# Altium schematic sheet HPDv2.SchDoc
size A4
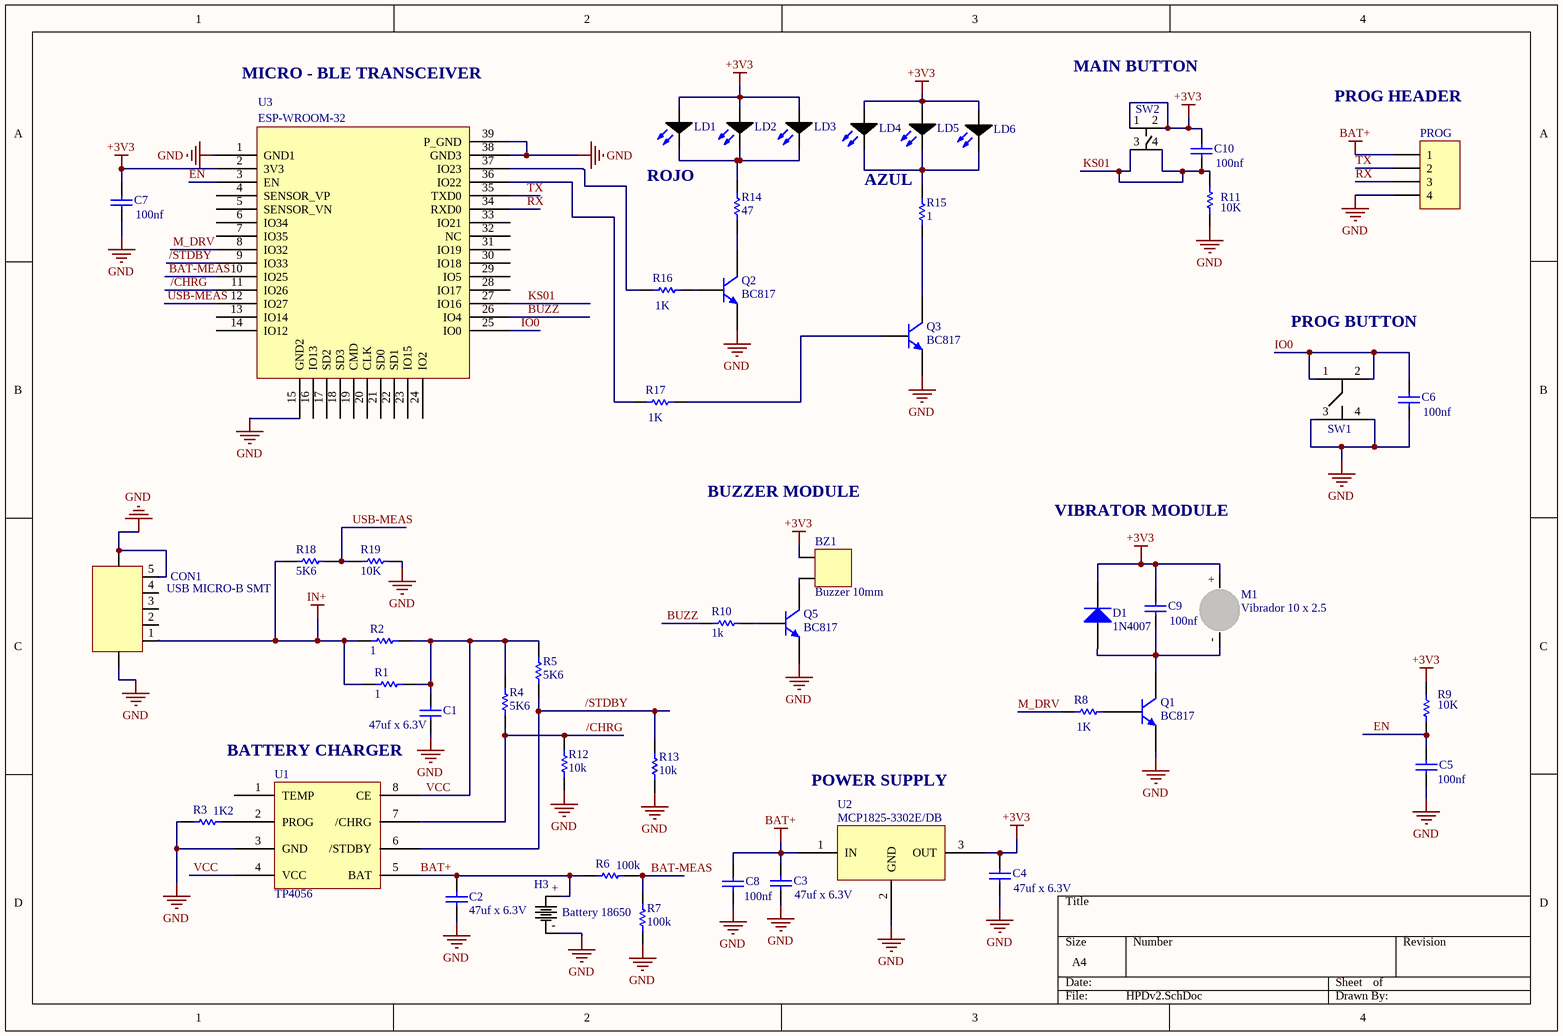
[diagram p0: HPDv2.SchDoc]

## Parts
BZ1  Buzzer 10mm  [BUZZER 10MM]
C1  Valor: 47uf x 6.3V  [8-1206 CAP]  (hidden comment: 47UFX6.3V 20%. TANT SMD1206)
C2  Valor: 47uf x 6.3V  [8-1206 CAP]  (hidden comment: 47UFX6.3V 20%. TANT SMD1206)
C3  Valor: 47uf x 6.3V  [8-1206 CAP]  (hidden comment: 47UFX6.3V 20%. TANT SMD1206)
C4  Valor: 47uf x 6.3V  [8-1206 CAP]  (hidden comment: 47UFX6.3V 20%. TANT SMD1206)
C5  Valor: 100nf  [0805 CAP]  (hidden comment: 100NFX50V X7R 10% CER.MULT. SMD 0805)
C6  Valor: 100nf  [0805 CAP]  (hidden comment: 100NFX50V X7R 10% CER.MULT. SMD 0805)
C7  Valor: 100nf  [0805 CAP]  (hidden comment: 100NFX50V X7R 10% CER.MULT. SMD 0805)
C8  Valor: 100nf  [0805 CAP]  (hidden comment: 100NFX50V X7R 10% CER.MULT. SMD 0805)
C9  Valor: 100nf  [0805 CAP]  (hidden comment: 100NFX50V X7R 10% CER.MULT. SMD 0805)
C10  Valor: 100nf  [0805 CAP]  (hidden comment: 100NFX50V X7R 10% CER.MULT. SMD 0805)
CON1  USB MICRO-B SMT  [MICRO USB-B SMT]
D1  Valor: 1N4007  [SMA]  (hidden comment: M7 DIODO 1A 1000V SMD-SMA (1N4007) XYG)
H3  Battery 18650  [Battery 18650 Holder SMD]
LD1  LED SMD 1206 FRONTAL (YOKE) ROJO WC 54mcd  [Diode-1206]  (value not drawn)
LD2  LED SMD 1206 FRONTAL (YOKE) ROJO WC 54mcd  [Diode-1206]  (value not drawn)
LD3  LED SMD 1206 FRONTAL (YOKE) ROJO WC 54mcd  [Diode-1206]  (value not drawn)
LD4  LED SMD 1206 AZUL WC 100mcd  [Diode-1206]  (value not drawn)
LD5  LED SMD 1206 AZUL WC 100mcd  [Diode-1206]  (value not drawn)
LD6  LED SMD 1206 AZUL WC 100mcd  [Diode-1206]  (value not drawn)
M1  Vibrador 10 x 2.5  [Vibrador]
PROG  POSTE RECTO 4C SF P=2.54MM 201-S104  [HDR1X4]  (value not drawn)
Q1  Valor: BC817  [SOT95P240-3N]  (hidden comment: BC817-40 TRA.NPN 45V0.5A 0.25W SOT23)
Q2  Valor: BC817  [SOT95P240-3N]  (hidden comment: BC817-40 TRA.NPN 45V0.5A 0.25W SOT23)
Q3  Valor: BC817  [SOT95P240-3N]  (hidden comment: BC817-40 TRA.NPN 45V0.5A 0.25W SOT23)
Q5  Valor: BC817  [SOT95P240-3N]  (hidden comment: BC817-40 TRA.NPN 45V0.5A 0.25W SOT23)
R1  Valor: 1  [0805 RES]  (hidden comment: 1E 5% 0805 1/8W)
R2  Valor: 1  [0805 RES]  (hidden comment: 1E 5% 0805 1/8W)
R3  Valor: 1K2  [0805 RES]  (hidden comment: 1K2 5% 0805 1/8W)
R4  Valor: 5K6  [0805 RES]  (hidden comment: 5.6K 5% 0805 1/8W RES.SMD)
R5  Valor: 5K6  [0805 RES]  (hidden comment: 5.6K 5% 0805 1/8W RES.SMD)
R6  Valor: 100k  [0805 RES]  (hidden comment: 100K 5% 0805 1/8W RES.SMD)
R7  Valor: 100k  [0805 RES]  (hidden comment: 100K 5% 0805 1/8W RES.SMD)
R8  Valor: 1K  [0805 RES]  (hidden comment: 1K 5% 0805 1/8W RES.SMD)
R9  Valor: 10K  [0805 RES]  (hidden comment: 10K 5% 0805 1/8W RES.SMD)
R10  Valor: 1k  [0805 RES]  (hidden comment: 1K 5% 0805 1/8W RES.SMD)
R11  Valor: 10K  [0805 RES]  (hidden comment: 10K 5% 0805 1/8W RES.SMD)
R12  Valor: 10k  [0805 RES]  (hidden comment: 10K 5% 0805 1/8W RES.SMD)
R13  Valor: 10k  [0805 RES]  (hidden comment: 10K 5% 0805 1/8W RES.SMD)
R14  Valor: 47  [0805 RES]  (hidden comment: 47E 5% 0805 1/8W RES.SMD)
R15  Valor: 1  [0805 RES]  (hidden comment: 1E 5% 0805 1/8W)
R16  Valor: 1K  [0805 RES]  (hidden comment: 1K 5% 0805 1/8W RES.SMD)
R17  Valor: 1K  [0805 RES]  (hidden comment: 1K 5% 0805 1/8W RES.SMD)
R18  Valor: 5K6  [0805 RES]  (hidden comment: 5.6K 5% 0805 1/8W RES.SMD)
R19  Valor: 10K  [0805 RES]  (hidden comment: 10K 5% 0805 1/8W RES.SMD)
SW1  TAC-SWITCH 4 CONT.6X6MM (7MM) 180GF  [SW - SMD]  (value not drawn)
SW2  Tact swith 12 x 12  [Tact swith 12 x 12]  (value not drawn)
U1  TP4056  [SOIC-8]
U2  Valor: MCP1825-3302E/DB  [SOT223]  (hidden comment: MCP1825S-3302E/DB SOT223)
U3  ESP32-WROOM-32D MODULO WI-FI+BLUETOOTH V4.2 SMD C/ANTENA  [ESP-WROOM-32]  (value not drawn)

## Nets
+3V3: BZ1.1 C4.2 C7.2 C9.2 C10.2 D1.2(K) LD1.1 LD2.1 LD3.1 LD4.1 LD5.1 LD6.1 M1.+ R9.2 SW2.1 SW2.2 U2.3(OUT) U3.2(3V3)
BAT+: C2.1 C3.2 C8.2 H3.+ PROG.1 R6.2 U1.5(BAT) U2.1(IN)
GND: C1.1 C2.2 C3.1 C4.1 C5.1 C6.1 C7.1 C8.1 CON1.5 CON1.6 H3.- PROG.4 Q1.2(E) Q2.2(E) Q3.2(E) Q5.2(E) R3.2 R7.2 R11.1 R12.2 R13.2 R19.1 SW1.3 SW1.4 U1.3(GND) U2.2(GND) U3.1(GND1) U3.15(GND2) U3.38(GND3) U3.39(P_GND)
IN+: CON1.1 R1.2 R2.2 R18.2
/CHRG: R4.2 R12.1 U1.7(/CHRG) U3.11(IO26)
/STDBY: R5.2 R13.1 U1.6(/STDBY) U3.9(IO33)
BAT-MEAS: R6.1 R7.1 U3.10(IO25)
BUZZ: R10.2 U3.26(IO4)
EN: C5.2 R9.1 U3.3(EN)
IO0: C6.2 SW1.1 SW1.2 U3.25(IO0)
KS01: C10.1 R11.2 SW2.3 SW2.4 U3.27(IO16)
M_DRV: R8.1 U3.8(IO32)
RX: PROG.3 U3.34(RXD0)
TX: PROG.2 U3.35(TXD0)
USB-MEAS: R18.1 R19.2 U3.12(IO27)
VCC: C1.2 R1.1 R2.1 R4.1 R5.1 U1.4(VCC) U1.8(CE)
NetBZ1_2: BZ1.2 Q5.3(C)
NetC9_1: C9.1 D1.1(A) M1.- Q1.3(C)
NetLD1_2: LD1.2 LD2.2 LD3.2 R14.2
NetLD4_2: LD4.2 LD5.2 LD6.2 R15.2
NetQ1_1: Q1.1(B) R8.2
NetQ2_1: Q2.1(B) R16.2
NetQ2_3: Q2.3(C) R14.1
NetQ3_1: Q3.1(B) R17.2
NetQ3_3: Q3.3(C) R15.1
NetQ5_1: Q5.1(B) R10.1
NetR3_1: R3.1 U1.2(PROG)
NetR16_1: R16.1 U3.37(IO23)
NetR17_1: R17.1 U3.36(IO22)

Not connected (* = marked no-connect by the designer): CON1 2 3 4; U1 1(TEMP); U3 4(SENSOR_VP) 5(SENSOR_VN) 6(IO34) 7(IO35) 13(IO14) 14(IO12) 16(IO13) 17(SD2) 18(SD3) 19(CMD) 20(CLK) 21(SD0) 22(SD1) 23(IO15) 24(IO2) 28(IO17) 29(IO5) 30(IO18) 31(IO19) 32(NC) 33(IO21)

## Notes on the sheet
- MICRO - BLE TRANSCEIVER
- MAIN BUTTON
- (near PROG) PROG HEADER
- (near LD1) ROJO
- AZUL
- PROG BUTTON
- BUZZER MODULE
- VIBRATOR MODULE
- (near U1) BATTERY CHARGER
- POWER SUPPLY

## Library data of the parts
BZ1 = Buzzer 10mm: BUZZER 3V CON OSCILADOR DE 10MM; COD. Elemon: OS9209000; COD. CIKA: TYD03 CN; COD. Microelectronica: *
C1-C4 = SMD Ceramic Capacitor SMD 0805 1206: COD. Elemon: CA3388044; Published: 8-Jun-2000; LatestRevisionDate: 17-Jul-2002; LatestRevisionNote: Re-released for DXP Platform.; Publisher: Altium Limited; PackageReference: 0805-1206; Codigo FV: *
C5-C10 = SMD Ceramic Capacitor SMD 0805 1206: COD. Elemon: CA3279775; Published: 8-Jun-2000; LatestRevisionDate: 17-Jul-2002; LatestRevisionNote: Re-released for DXP Platform.; Publisher: Altium Limited; PackageReference: 0805-1206; Codigo FV: *
CON1 = USB MICRO-B SMT: USB MICRO-B SMT CONNECTOR; ComponentLink1Description: Footprint model; ComponentLink1URL: https://respuestas.me/q/montaje-del-conector-micro-usb-b-en-una-pcb-62251001016
D1 = Diode SS14: COD. Elemon: DI1202221; PackageReference: SMA; ComponentLink1Description: Manufacturer Link; ComponentLink1URL: https://www.vishay.com/; ComponentLink2Description: Datasheet; ComponentLink2URL: https://www.vishay.com/docs/88746/ss12.pdf
H3 = Battery 18650 Holder SMD: Battery Holder 18650 SMD TAP
LD1-LD3 = LED 1206: COD. Elemon: OP1574060
LD4-LD6 = LED 1206: COD. Elemon: OP1574077
M1 = Vibrador 10 x 2.5: Vibrador 10 x 2.5 de 3V
PROG = Header 4: COD. Elemon: CO4900900; LatestRevisionDate: 17-Jul-2002; LatestRevisionNote: Re-released for DXP Platform.; Publisher: Altium Limited
Q1-Q3 Q5 = NPN SMD SOT-23: COD. Elemon: TR1723020; Published: 8-Jun-2000; LatestRevisionDate: 29-May-2009; LatestRevisionNote: IPC-7351 Footprint Added.; PackageVersion: Aug-1999; PackageReference: SOT-23B; Publisher: Altium Limited; PackageDescription: 3-Pin SOT-23 Package 0.95 mm Pitch, 2.4 mm Lead Span; Codigo FV: *
R1 R2 R15 = RES SMD 0805 1206: COD. Elemon: RS3896005; PackageReference: 0805-1206; Codigo FV: *
R3 = RES SMD 0805 1206: COD. Elemon: RS3896190; PackageReference: 0805-1206; Codigo FV: *
R4 R5 R18 = RES SMD 0805 1206: COD. Elemon: RS3896230; PackageReference: 0805-1206; Codigo FV: *
R6 R7 = RES SMD 0805 1206: COD. Elemon: RS3896305; PackageReference: 0805-1206; Codigo FV: *
R8 R10 R16 R17 = RES SMD 0805 1206: COD. Elemon: RS3896185; PackageReference: 0805-1206; Codigo FV: *
R9 R11-R13 R19 = RES SMD 0805 1206: COD. Elemon: RS3896245; PackageReference: 0805-1206; Codigo FV: *
R14 = RES SMD 0805 1206: COD. Elemon: RS3896105; PackageReference: 0805-1206; Codigo FV: *
SW1 = TACT_SW: COD. Elemon: SW5702109
U1 = TP4056: Linear Li-lon Battery Charger; ComponentLink1Description: Datasheet; ComponentLink1URL: http://www.datasheetcafe.com/tp4056-datasheet-battery-charger/
U2 = MCP1703-3302E/DB: 250 mA, 16V, Vo = 3.3V, Low Quiescent Current LDO Regulator; Codigo FV: CE.SEM.0001; COD. Elemon: CI2709140; PackageReference: SOT223; ComponentLink2Description: Datasheet; ComponentLink2URL: http://ww1.microchip.com/downloads/en/DeviceDoc/22049f.pdf; ComponentLink3Description: Datasheet MCP1825; ComponentLink3URL: http://ww1.microchip.com/downloads/en/DeviceDoc/22056b.pdf
U3 = ESP-WROOM-32: COD. Elemon: RF9301435; ComponentLink1Description: Datasheet; ComponentLink1URL: https://www.espressif.com/en/esp-wroom-32/resources; Valor: ESP-WROOM-32